# Altium schematic sheet Page 3_PMIC.SchDoc
size A2; Scale: 1:1; SheetNumber: 1; SheetTotal: 3
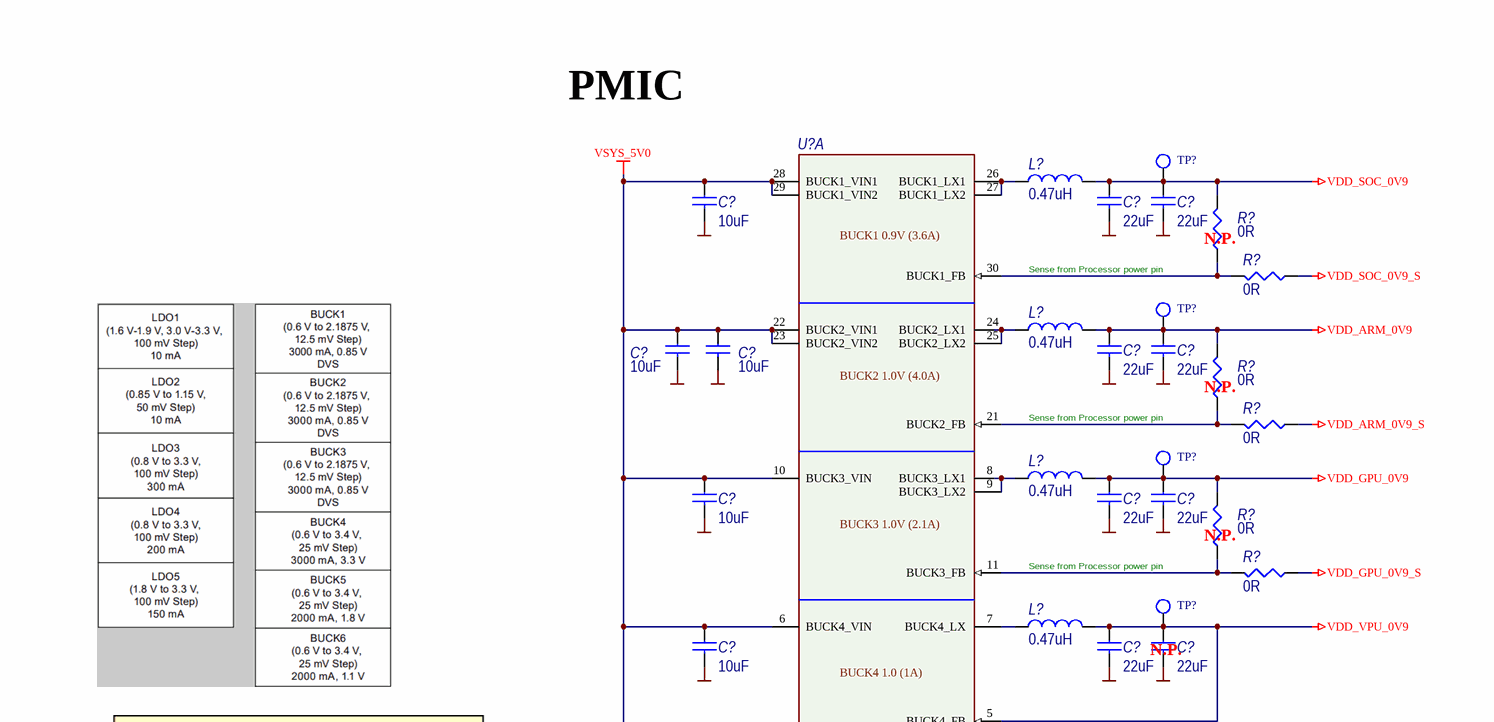
[diagram p0: Page 3_PMIC.SchDoc, top left]
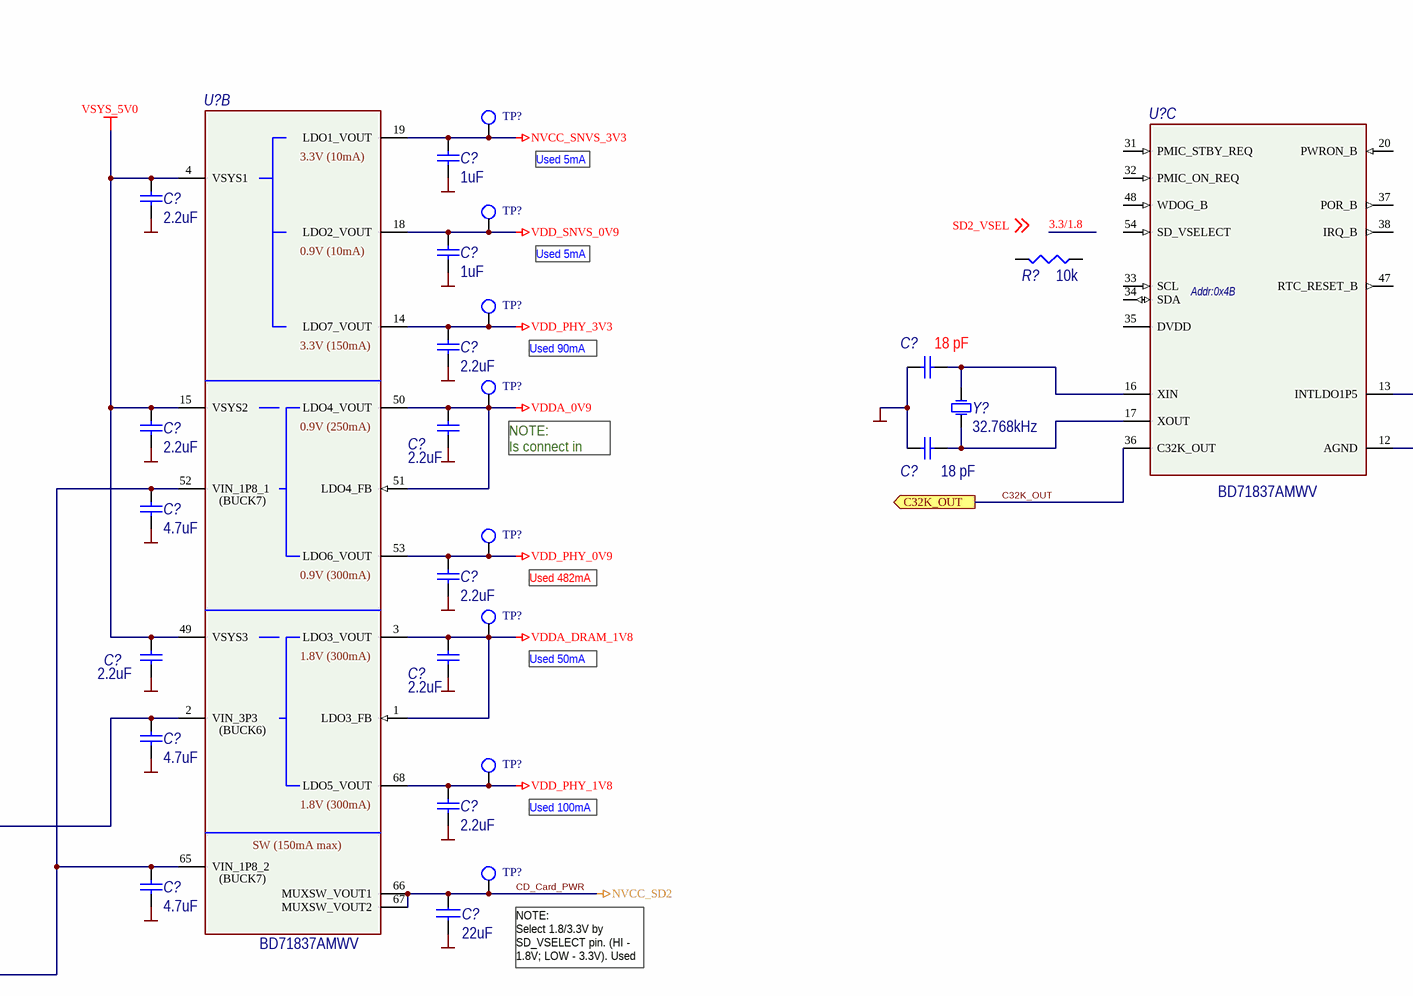
[diagram p1: Page 3_PMIC.SchDoc, top middle]
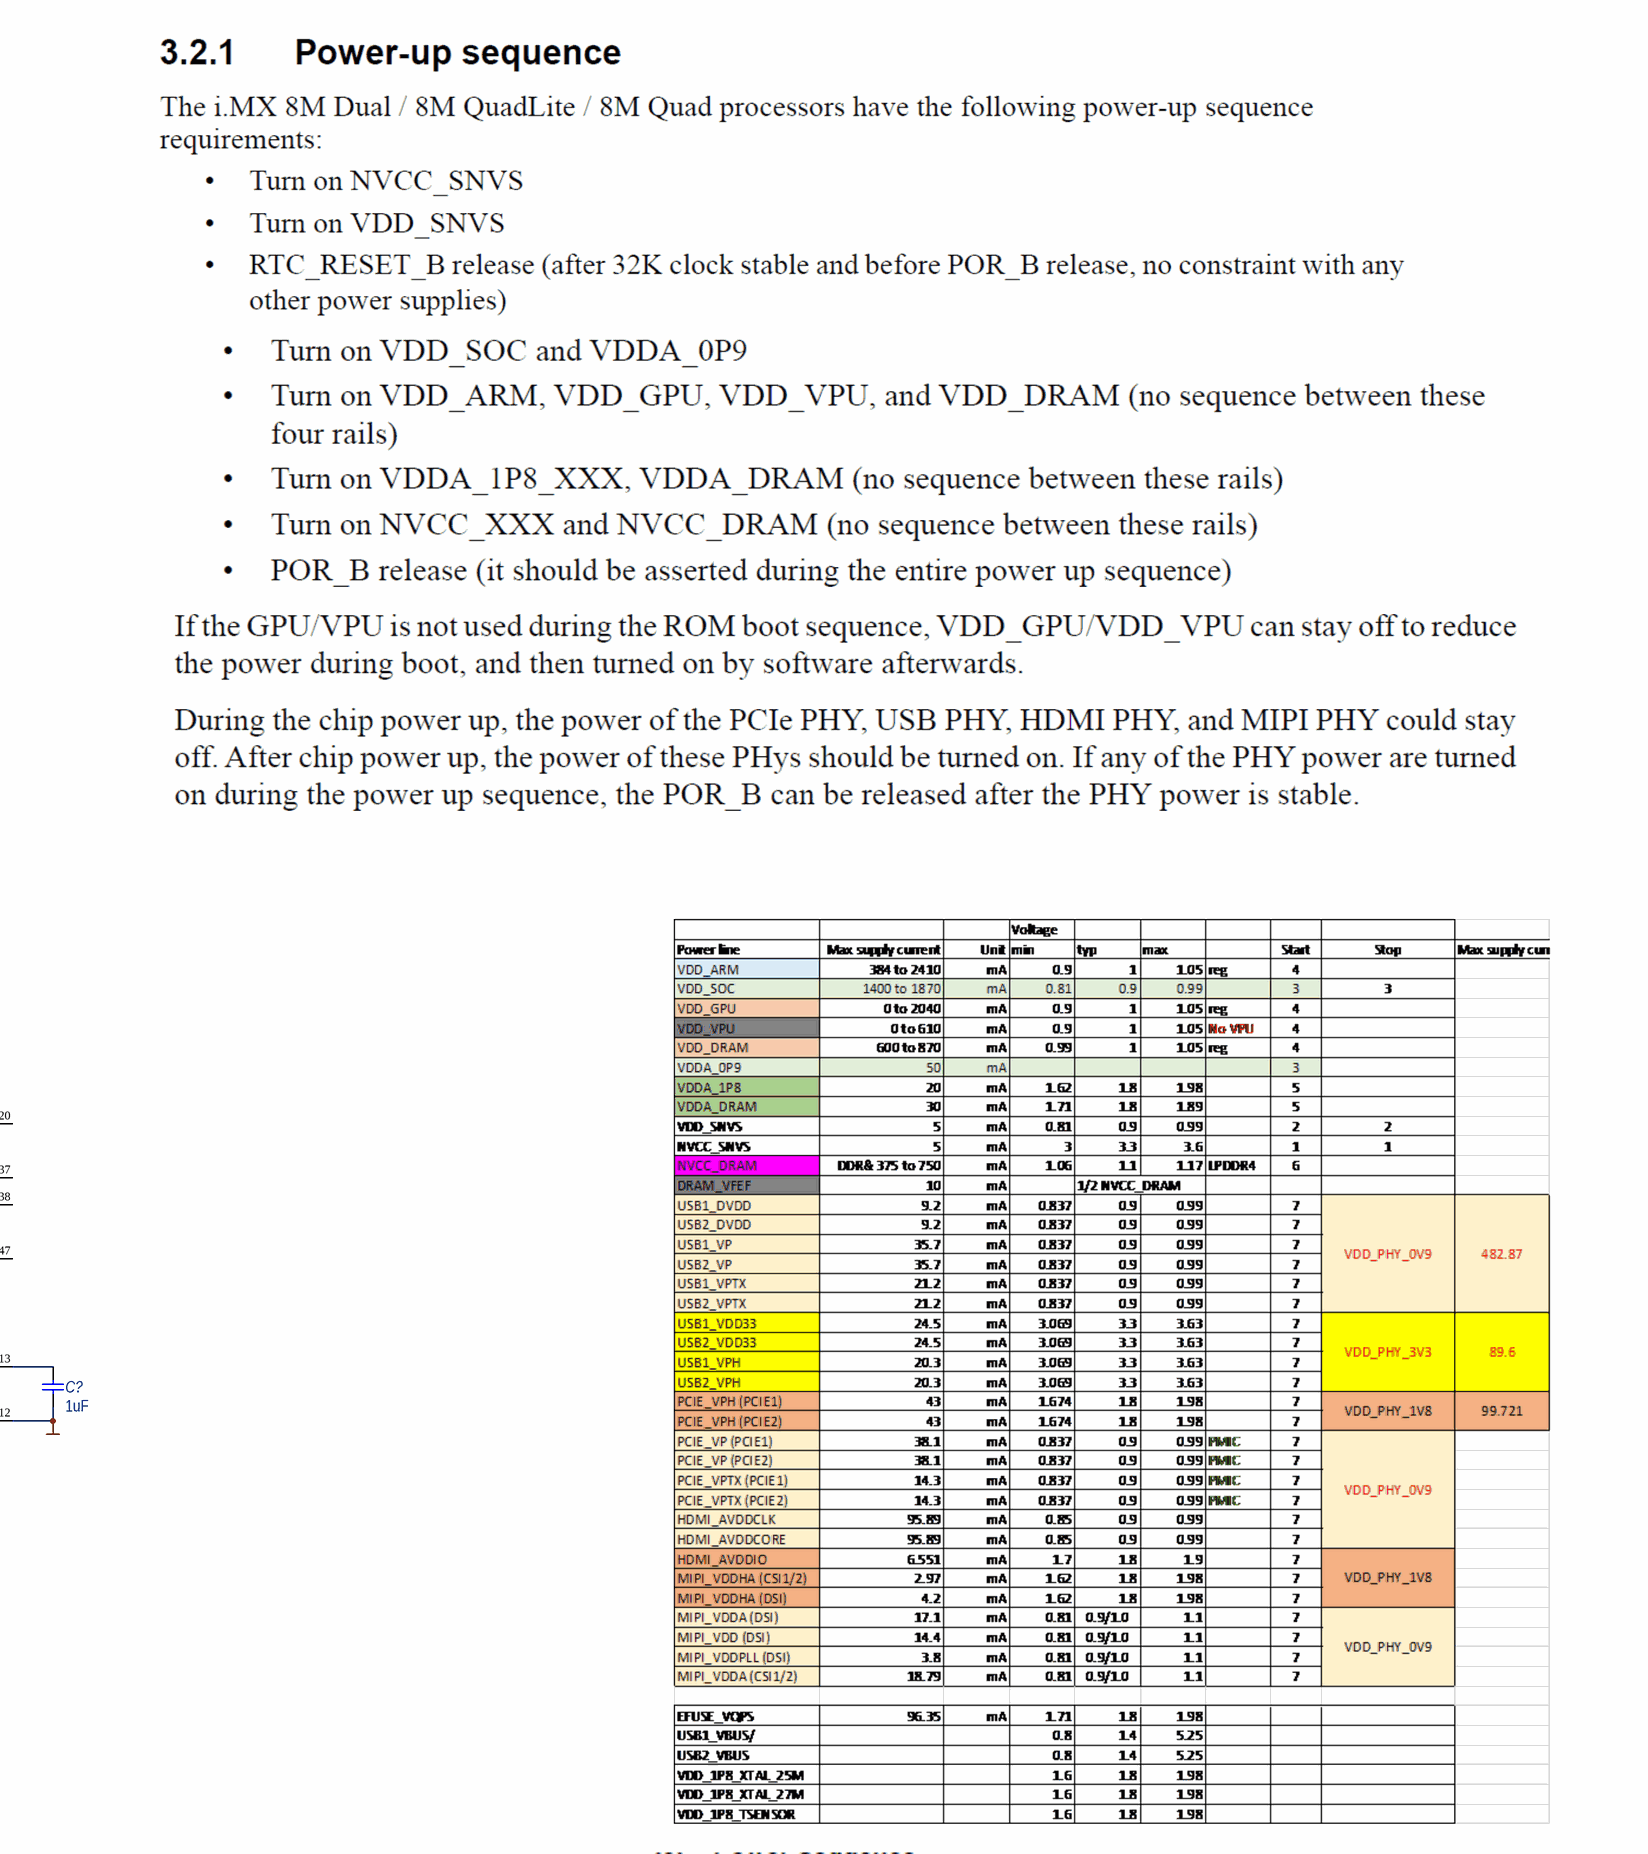
[diagram p2: Page 3_PMIC.SchDoc, top right]
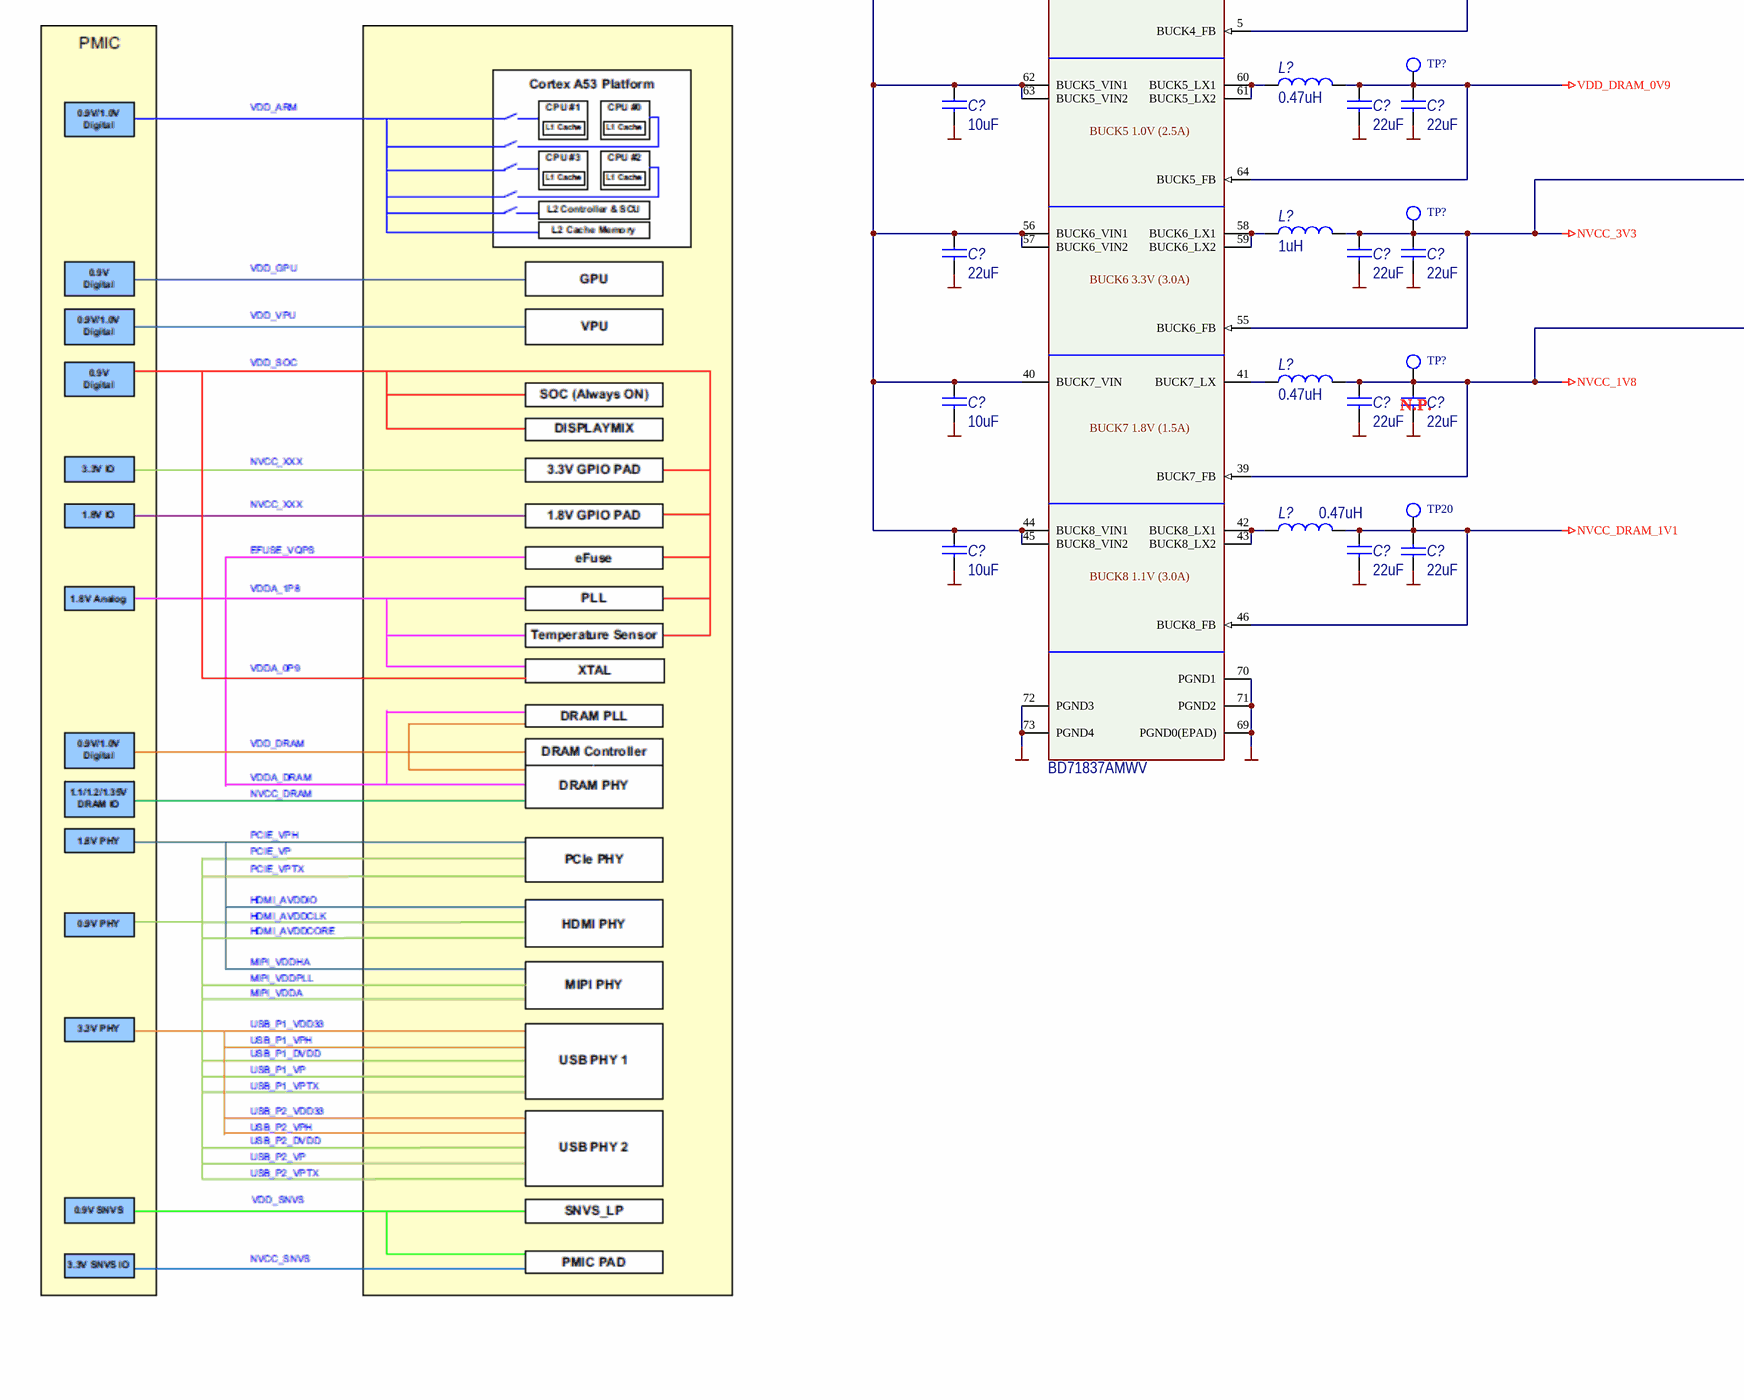
[diagram p3: Page 3_PMIC.SchDoc, bottom left]
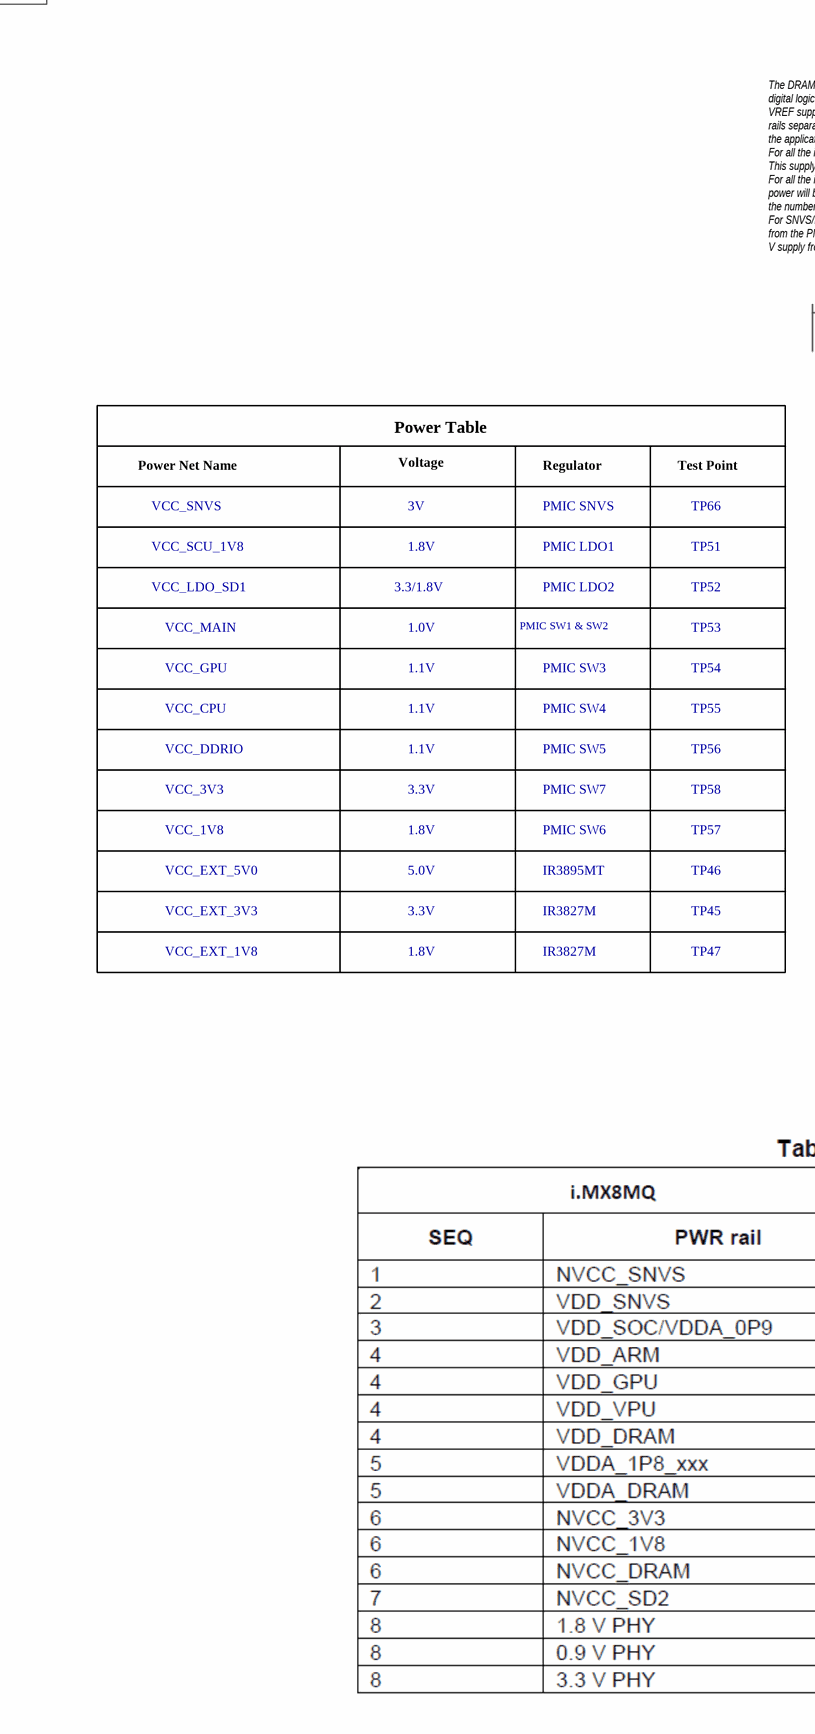
[diagram p4: Page 3_PMIC.SchDoc, bottom middle]
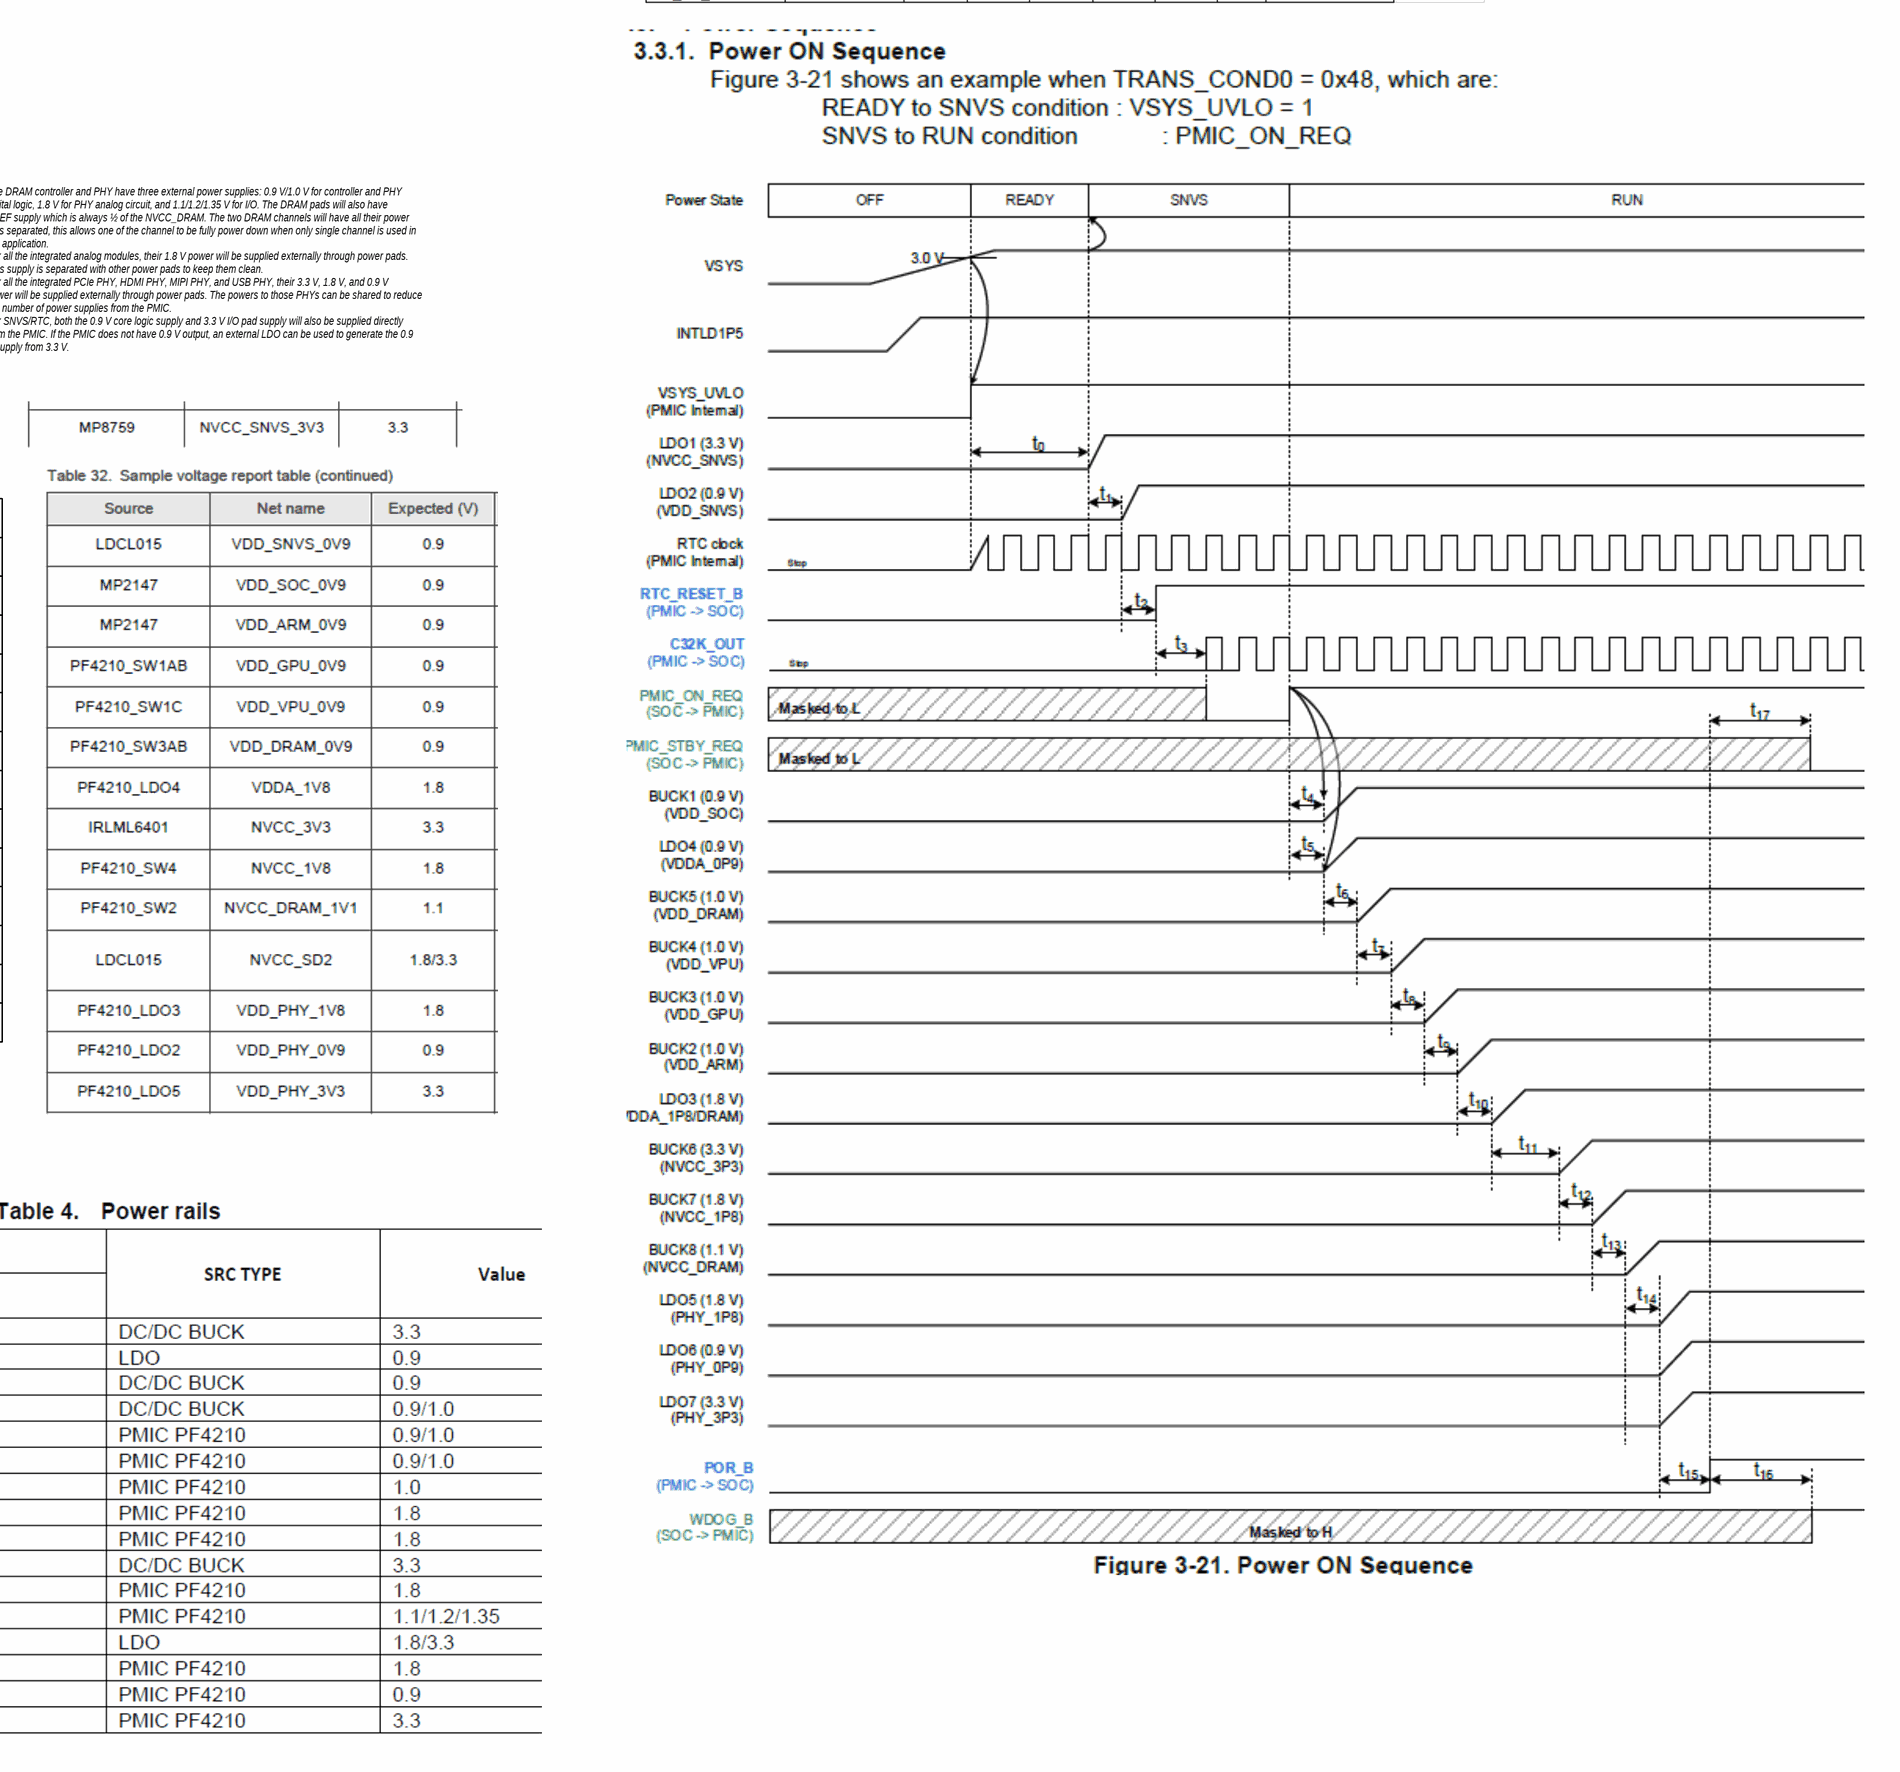
[diagram p5: Page 3_PMIC.SchDoc, bottom right]

## Parts
(Parts that share a designator on the sheet are numbered #1, #2 ... from top to bottom, then left to right.)
C?#1  10uF  [CC0603_H0.8_L-R]
C?#2  22uF  [CC0603_H0.8_L-R]
C?#3  22uF  [CC0603_H0.8_L-R]
C?#4  1uF  [CC0402_L-R]
C?#5  2.2uF  [CC0402_L-R]
C?#6  1uF  [CC0402_L-R]
C?#7  10uF  [CC0603_H0.8_L-R]
C?#8  10uF  [CC0603_H0.8_L-R]
C?#9  22uF  [CC0603_H0.8_L-R]
C?#10  22uF  [CC0603_H0.8_L-R]
C?#11  2.2uF  [CC0402_L-R]
C?#12  18 pF  [CC0402_L-R]
C?#13  1uF  [CC0402_L-R]
C?#14  2.2uF  [CC0402_L-R]
C?#15  2.2uF  [CC0402_L-R]
C?#16  10uF  [CC0603_H0.8_L-R]
C?#17  22uF  [CC0603_H0.8_L-R]
C?#18  22uF  [CC0603_H0.8_L-R]
C?#19  18 pF  [CC0402_L-R]
C?#20  4.7uF  [CC0402_L-R]
C?#21  2.2uF  [CC0402_L-R]
C?#22  10uF  [CC0603_H0.8_L-R]
C?#23  22uF  [CC0603_H0.8_L-R]
C?#24  22uF  [CC0603_H0.8_L-R]  (no BOM)
C?#25  2.2uF  [CC0402_L-R]
C?#26  2.2uF  [CC0402_L-R]
C?#27  4.7uF  [CC0402_L-R]
C?#28  10uF  [CC0603_H0.8_L-R]
C?#29  22uF  [CC0603_H0.8_L-R]
C?#30  22uF  [CC0603_H0.8_L-R]
C?#31  2.2uF  [CC0402_L-R]
C?#32  4.7uF  [CC0402_L-R]
C?#33  22uF  [CC0603_H0.8_L-R]
C?#34  22uF  [CC0603_H0.8_L-R]
C?#35  22uF  [CC0603_H0.8_L-R]
C?#36  22uF  [CC0603_H0.8_L-R]
C?#37  10uF  [CC0603_H0.8_L-R]
C?#38  22uF  [CC0603_H0.8_L-R]
C?#39  22uF  [CC0603_H0.8_L-R]  (no BOM)
C?#40  10uF  [CC0603_H0.8_L-R]
C?#41  22uF  [CC0603_H0.8_L-R]
C?#42  22uF  [CC0603_H0.8_L-R]
L?#1  0.47uH  [IND_1008_DFE252012]
L?#2  0.47uH  [IND_1008_DFE252012]
L?#3  0.47uH  [IND_1008_DFE252012]
L?#4  0.47uH  [IND_1008_DFE252012]
L?#5  0.47uH  [IND_1008_DFE252012]
L?#6  1uH  [IND_1008_DFE252012]
L?#7  0.47uH  [IND_1008_DFE252012]
L?#8  0.47uH  [IND_1008_DFE252012]
R?#1  0R  [R0402_L_R]  (no BOM)
R?#2  0R  [R0402_L_R]  (no BOM)
R?#3  10k  [R0402_L_R]
R?#4  0R  [R0402_L_R]  (no BOM)
R?#5  0R  [R0402_L_R]  (no BOM)
R?#6  0R  [R0402_L_R]  (no BOM)
R?#7  0R  [R0402_L_R]  (no BOM)
TP20  TestPoint-1  [Test_Point_dia-1mm]  (value not drawn)  (no BOM)
TP?#1  TestPoint-1  [Test_Point_dia-1mm]  (value not drawn)  (no BOM)
TP?#2  TestPoint-1  [Test_Point_dia-1mm]  (value not drawn)  (no BOM)
TP?#3  TestPoint-1  [Test_Point_dia-1mm]  (value not drawn)  (no BOM)
TP?#4  TestPoint-1  [Test_Point_dia-1mm]  (value not drawn)  (no BOM)
TP?#5  TestPoint-1  [Test_Point_dia-1mm]  (value not drawn)  (no BOM)
TP?#6  TestPoint-1  [Test_Point_dia-1mm]  (value not drawn)  (no BOM)
TP?#7  TestPoint-1  [Test_Point_dia-1mm]  (value not drawn)  (no BOM)
TP?#8  TestPoint-1  [Test_Point_dia-1mm]  (value not drawn)  (no BOM)
TP?#9  TestPoint-1  [Test_Point_dia-1mm]  (value not drawn)  (no BOM)
TP?#10  TestPoint-1  [Test_Point_dia-1mm]  (value not drawn)  (no BOM)
TP?#11  TestPoint-1  [Test_Point_dia-1mm]  (value not drawn)  (no BOM)
TP?#12  TestPoint-1  [Test_Point_dia-1mm]  (value not drawn)  (no BOM)
TP?#13  TestPoint-1  [Test_Point_dia-1mm]  (value not drawn)  (no BOM)
TP?#14  TestPoint-1  [Test_Point_dia-1mm]  (value not drawn)  (no BOM)
TP?#15  TestPoint-1  [Test_Point_dia-1mm]  (value not drawn)  (no BOM)
U?#1  BD71837AMWV  [UQFN68CV8080_ROHM]  (part A of 3)
U?#2  BD71837AMWV  [UQFN68CV8080_ROHM]  (part B of 3)
U?#3  BD71837AMWV  [UQFN68CV8080_ROHM]  (part C of 3)
Y?  32.768kHz  [FC-135_QUARTZ]

## Ports
C32K_OUT (out)

## Nets
0V: C?#1.2 C?#2.2 C?#3.2 C?#4.1 C?#5.1 C?#6.1 C?#7.2 C?#8.2 C?#9.2 C?#10.2 C?#11.1 C?#12.2 C?#13.1 C?#14.1 C?#15.1 C?#16.2 C?#17.2 C?#18.2 C?#19.2 C?#20.1 C?#21.1 C?#22.2 C?#23.2 C?#24.2 C?#25.1 C?#26.1 C?#27.1 C?#28.2 C?#29.2 C?#30.2 C?#31.1 C?#32.1 C?#33.2 C?#34.2 C?#35.2 C?#36.2 C?#37.2 C?#38.2 C?#39.2 C?#40.2 C?#41.2 C?#42.1 U?#1.69(PGND0(EPAD)) U?#1.70(PGND1) U?#1.71(PGND2) U?#1.72(PGND3) U?#1.73(PGND4) U?#3.12(AGND)
CD_Card_PWR: C?#36.1 TP?#14.1 U?#2.66(MUXSW_VOUT1) U?#2.67(MUXSW_VOUT2)  [also labelled NVCC_SD2]
NVCC_1V8: C?#20.2 C?#32.2 C?#38.1 C?#39.1 L?#7.2 TP?#15.1 U?#1.39(BUCK7_FB) U?#2.52(VIN_1P8_1) U?#2.65(VIN_1P8_2)
NVCC_3V3: C?#27.2 C?#34.1 C?#35.1 L?#6.2 TP?#13.1 U?#1.55(BUCK6_FB) U?#2.2(VIN_3P3)
NVCC_DRAM_1V1: C?#41.1 C?#42.2 L?#8.2 TP20.1 U?#1.46(BUCK8_FB)
NVCC_SNVS_3V3: C?#4.2 TP?#2.1 U?#2.19(LDO1_VOUT)
VDD_ARM_0V9: C?#9.1 C?#10.1 L?#2.2 R?#4.2 TP?#4.1
VDD_ARM_0V9_S: R?#5.1
VDD_DRAM_0V9: C?#29.1 C?#30.1 L?#5.2 TP?#11.1 U?#1.64(BUCK5_FB)
VDD_GPU_0V9: C?#17.1 C?#18.1 L?#3.2 R?#6.2 TP?#7.1
VDD_GPU_0V9_S: R?#7.1
VDD_PHY_0V9: C?#21.2 TP?#8.1 U?#2.53(LDO6_VOUT)
VDD_PHY_1V8: C?#31.2 TP?#12.1 U?#2.68(LDO5_VOUT)
VDD_PHY_3V3: C?#11.2 TP?#5.1 U?#2.14(LDO7_VOUT)
VDD_SNVS_0V9: C?#6.2 TP?#3.1 U?#2.18(LDO2_VOUT)
VDD_SOC_0V9: C?#2.1 C?#3.1 L?#1.2 R?#1.2 TP?#1.1
VDD_SOC_0V9_S: R?#2.1
VDD_VPU_0V9: C?#23.1 C?#24.1 L?#4.2 TP?#9.1 U?#1.5(BUCK4_FB)
VDDA_0V9: C?#15.2 TP?#6.1 U?#2.50(LDO4_VOUT) U?#2.51(LDO4_FB)
VDDA_DRAM_1V8: C?#26.2 TP?#10.1 U?#2.1(LDO3_FB) U?#2.3(LDO3_VOUT)
VSYS_5V0: C?#1.1 C?#5.2 C?#7.1 C?#8.1 C?#14.2 C?#16.1 C?#22.1 C?#25.2 C?#28.1 C?#33.1 C?#37.1 C?#40.1 U?#1.6(BUCK4_VIN) U?#1.10(BUCK3_VIN) U?#1.22(BUCK2_VIN1) U?#1.23(BUCK2_VIN2) U?#1.28(BUCK1_VIN1) U?#1.29(BUCK1_VIN2) U?#1.40(BUCK7_VIN) U?#1.44(BUCK8_VIN1) U?#1.45(BUCK8_VIN2) U?#1.56(BUCK6_VIN1) U?#1.57(BUCK6_VIN2) U?#1.62(BUCK5_VIN1) U?#1.63(BUCK5_VIN2) U?#2.4(VSYS1) U?#2.15(VSYS2) U?#2.49(VSYS3)
C32K_OUT: U?#3.36(C32K_OUT) ; port C32K_OUT
NetC?#12_1: C?#12.1 U?#3.16(XIN) Y?.2(OSC2)
NetC?#13_2: C?#13.2 U?#3.13(INTLDO1P5)
NetC?#19_1: C?#19.1 U?#3.17(XOUT) Y?.1(OSC1)
NetL?#1_1: L?#1.1 U?#1.26(BUCK1_LX1) U?#1.27(BUCK1_LX2)
NetL?#2_1: L?#2.1 U?#1.24(BUCK2_LX1) U?#1.25(BUCK2_LX2)
NetL?#3_1: L?#3.1 U?#1.8(BUCK3_LX1) U?#1.9(BUCK3_LX2)
NetL?#4_1: L?#4.1 U?#1.7(BUCK4_LX)
NetL?#5_1: L?#5.1 U?#1.60(BUCK5_LX1) U?#1.61(BUCK5_LX2)
NetL?#6_1: L?#6.1 U?#1.58(BUCK6_LX1) U?#1.59(BUCK6_LX2)
NetL?#7_1: L?#7.1 U?#1.41(BUCK7_LX)
NetL?#8_1: L?#8.1 U?#1.42(BUCK8_LX1) U?#1.43(BUCK8_LX2)
NetR?#1_1: R?#1.1 R?#2.2 U?#1.30(BUCK1_FB)
NetR?#4_1: R?#4.1 R?#5.2 U?#1.21(BUCK2_FB)
NetR?#6_1: R?#6.1 R?#7.2 U?#1.11(BUCK3_FB)

Not connected (* = marked no-connect by the designer): R?#3 1 2; U?#3 20(PWRON_B) 31(PMIC_STBY_REQ) 32(PMIC_ON_REQ) 33(SCL) 34(SDA) 35(DVDD) 37(POR_B) 38(IRQ_B) 47(RTC_RESET_B) 48(WDOG_B) 54(SD_VSELECT)

## Notes on the sheet
- PMIC
- (near R?#1) N.P.
- Used 5mA
- Sense from Processor power pin
- (near R?#4) N.P.
- (near TP?#5) Used 90mA
- (near TP?#6) NOTE:
  Is connect in CPU
- (near R?#6) N.P.
- (near C?#24) N.P.
- (near TP?#8) Used 482mA !
- (near TP?#10) Used 50mA
- (near TP?#12) Used 100mA
- (near TP?#14) NOTE:
  Select 1.8/3.3V by SD_VSELECT pin. (HI - 1.8V; LOW - 3.3V). Used 100mA
- (near C?#39) N.P.
- The DRAM controller and PHY have three external power supplies: 0.9 V/1.0 V for controller and PHY
  digital logic, 1.8 V for PHY analog circuit, and 1.1/1.2/1.35 V for I/O. The DRAM pads will also have
  VREF supply which is always ½ of the NVCC_DRAM. The two DRAM channels will have all their power
  rails separated, this allows one of the channel to be fully power down when only single channel is used in
  the application.
  For all the integrated analog modules, their 1.8 V power will be supplied externally through power pads.
  This supply is separated with other power pads to keep them clean.
  For all the integrated PCIe PHY, HDMI PHY, MIPI PHY, and USB PHY, their 3.3 V, 1.8 V, and 0.9 V
  power will be supplied externally through power pads. The powers to those PHYs can be shared to reduce
  the number of power supplies from the PMIC.
  For SNVS/RTC, both the 0.9 V core logic supply and 3.3 V I/O pad supply will also be supplied directly
  from the PMIC. If the PMIC does not have 0.9 V output, an external LDO can be used to generate the 0.9
  V supply from 3.3 V.
- Power Table
- Power Net Name
- VCC_SNVS
- Voltage
- 3V
- Regulator
- PMIC SNVS
- Test Point
- TP66
- VCC_SCU_1V8
- VCC_LDO_SD1
- 3.3/1.8V
- 1.8V
- PMIC LDO1
- PMIC LDO2
- TP51
- TP52
- VCC_MAIN
- 1.0V
- PMIC SW1 & SW2
- TP53
- VCC_GPU
- VCC_CPU
- 1.1V
- PMIC SW3
- PMIC SW4
- TP54
- TP55
- VCC_DDRIO
- VCC_3V3
- 3.3V
- PMIC SW5
- PMIC SW7
- TP56
- TP58
- VCC_1V8
- PMIC SW6
- TP57
- VCC_EXT_5V0
- VCC_EXT_3V3
- 5.0V
- IR3895MT
- IR3827M
- TP46
- TP45
- VCC_EXT_1V8
- TP47
- Labels drawn without touching a wire or pin: SD2_VSEL
- Title
- Size:
- Date:
- A3
- Revision:
- Sheet
- of
- Drawn By:
- Checked By:
- Black
- File:
- (in symbol BD71837AMWV, part A) BUCK1 0.9V (3.6A); BUCK2 1.0V (4.0A); BUCK3 1.0V (2.1A); BUCK4 1.0 (1A); BUCK5 1.0V (2.5A); BUCK6 3.3V (3.0A); BUCK7 1.8V (1.5A); BUCK8 1.1V (3.0A)
- (in symbol BD71837AMWV, part B) 3.3V (10mA); 0.9V (10mA); 3.3V (150mA); 0.9V (250mA); (BUCK7); 0.9V (300mA); 1.8V (300mA); (BUCK6); SW (150mA max)
- (in symbol BD71837AMWV, part C) Addr:0x4B

## Library data of the parts
C?#1 C?#7 C?#8 C?#16 C?#22 C?#28 C?#37 C?#40 = CC0603-10UF±10%-16V-X5R-MUR: CAP CER 10 uF 16V 10% X5R 0603; Manufacturer: Murata; Manufacturer Part Number: GRM188R61C106KAALD; Mount: Surface Mount; Case/Package: 0603; Case Code (Metric): 1608; Case Code (Imperial): 0603; Weight: 0.000222oz; Min Operating Temperature: -55°C; Max Operating Temperature: 85°C; Capacitance: 10uF; Packaging: Tape and Reel; Voltage Rating: 16V; Dielectric: X5R; Tolerance: 10%; Termination: SMD/SMT; Resistor Type: Ceramic; Voltage Rating (DC): 16V; Package Quantity: 4000; Length: 0.063inch; Width: 0.8mm; Height: 0.8mm; Thickness: 0.037inch; REACH SVHC: No SVHC; Lead Free: Lead Free; RoHS Compliant: Yes; ComponentLink1URL: http://www.mouser.com/ds/2/281/c02e-2905.pdf?src-supplier=Mouser; ComponentLink1Description: http://www.mouser.com/ds/2/281/c02e-2905.pdf?src-supplier=Mouser; ComponentLink2URL: http://www.farnell.com/datasheets/2079167.pdf?src-supplier=Farnell; ComponentLink2Description: http://www.farnell.com/datasheets/2079167.pdf?src-supplier=Farnell; ComponentLink3URL: http://www.farnell.com/datasheets/2079167.pdf?src-supplier=Element14; ComponentLink3Description: http://www.farnell.com/datasheets/2079167.pdf?src-supplier=Element14; ComponentLink4URL: http://www.farnell.com/datasheets/2079167.pdf?src-supplier=Newark; ComponentLink4Description: http://www.farnell.com/datasheets/2079167.pdf?src-supplier=Newark; ComponentLink5URL: https://search.murata.co.jp/Ceramy/image/img/A01X/G101/ENG/GRM188R61C106KAAL-01.pdf?src-supplier=Digi-Key; ComponentLink5Description: https://search.murata.co.jp/Ceramy/image/img/A01X/G101/ENG/GRM188R61C106KAAL-01.pdf?src-supplier=Digi-Key; Supplier 1: LCSC; Supplier Part Number 1: C86275; RoHS: Yes; Category: Ceramic Capacitors; Stock 1: 156690; Pricing 1: 500=0.0604 USD
C?#2 C?#3 C?#9 C?#10 C?#17 C?#18 C?#23 C?#24 C?#29 C?#30 C?#33-C?#36 C?#38 C?#39 C?#41 C?#42 = GRM188R61A226ME15J: CAP CER 22 uF 10V 20% X5R 0603; Manufacturer: Murata; ComponentLink1URL: http://www.murata.com/products/catalog/pdf/c02e.pdf; ComponentLink1Description: http://www.murata.com/products/catalog/pdf/c02e.pdf; Supplier 1: Digi-Key; Manufacturer Part Number: GRM188R61A226ME15J; Category: Ceramic Capacitors; Stock 1: 24355; Pricing 1: 1=0.18000, 10=0.12500, 50=0.07500, 100=0.06340, 500=0.04336, 1000=0.03835, 2500=0.03668, 5000=0.03335 (USD); Voltage Rating (DC): 10V; Dielectric: X5R; Tolerance: 20%; Value: 22uF; Length: 1.6mm; Width: 800um; Thickness: 800um; RoHS Compliant: Yes; ComponentLink2URL: http://search.murata.co.jp/Ceramy/image/img/A01X/G101/ENG/GRM188R61A226ME15-01.pdf?src-supplier=Digi-Key; ComponentLink2Description: http://search.murata.co.jp/Ceramy/image/img/A01X/G101/ENG/GRM188R61A226ME15-01.pdf?src-supplier=Digi-Key; Supplier Part Number 1: 490-GRM188R61A226ME15JCT-ND
C?#4 C?#6 C?#13 = GRM155R61E105KA12D: CAP CER 1µF 25V X5R 10% 0402 Murata; Material: Ceramic; Mount: Surface Mount; Case/Package: 0402; Case Code (Metric): 1005; Case Code (Imperial): 0402; Weight: 0.000212oz; Min Operating Temperature: -55°C; Max Operating Temperature: 85°C; Tolerance: 10%; Capacitance: 1uF; Voltage Rating: 25V; Packaging: Tape and Reel; Dielectric: X5R; Voltage: 25V; Termination: SMD/SMT; Voltage Rating (DC): 25V; Package Quantity: 10000; Series: GRM; Length: 1mm; Width: 0.5mm; Height: 0.5mm; Thickness: 0.022inch; Depth: 0.5mm; REACH SVHC: No SVHC; Lead Free: Lead Free; RoHS Compliant: Yes; ComponentLink1URL: https://datasheet.ciiva.com/22732/1666664-22732122.pdf?src-supplier=Element14; ComponentLink1Description: https://datasheet.ciiva.com/22732/1666664-22732122.pdf?src-supplier=Element14; ComponentLink2URL: https://datasheet.ciiva.com/7719/1666664-7719006.pdf?src-supplier=Element14; ComponentLink2Description: https://datasheet.ciiva.com/7719/1666664-7719006.pdf?src-supplier=Element14; Manufacturer: Murata; Manufacturer Part Number: GRM155R61E105KA12D; RoHS: Yes; Category: Ceramic Capacitors; Stock 1: 424050; Pricing 1: 50=0,03227, 500=0,02420, 1500=0,02272, 5000=0,02124, 25000=0,02058, 50000=0,02025 (USD); Supplier 1: LCSC; Supplier Part Number 1: C77009
C?#5 C?#11 C?#14 C?#15 C?#21 C?#25 C?#26 C?#31 = GRT155R61C225KE13D: CAP CER 2.2 uF 16V X5R 10% 0402 Murata; Supplier 1: Digi-Key; Supplier Part Number 1: 490-12259-1-ND; Manufacturer: Murata; Manufacturer Part Number: GRT155R61C225KE13D; Category: Ceramic Capacitors; Stock 1: 60026; Pricing 1: 1=0.16000, 10=0.11000, 50=0.06260, 100=0.05190, 500=0.03638, 1000=0.03012, 2500=0.02803, 5000=0.02565 (USD); Mounting Technology: Surface Mount; Case/Package: 0402; Case Code (Metric): 1005; Case Code (Imperial): 0402; Min Operating Temperature: -55°C; Max Operating Temperature: 85°C; Packaging: Tape and Reel; Value: 2.2uF; Voltage Rating: 16V; Tolerance: 10%; Length: 0.039inch; Width: 0.02inch; Thickness: 0.022inch; Ratings: AEC-Q200; RoHS Compliant: Yes; ComponentLink1URL: http://search.murata.co.jp/Ceramy/image/img/A01X/G101/ENG/GRT155R61C225KE13-01.pdf?src-supplier=Digi-Key; ComponentLink1Description: http://search.murata.co.jp/Ceramy/image/img/A01X/G101/ENG/GRT155R61C225KE13-01.pdf?src-supplier=Digi-Key
C?#12 C?#19 = GRM1555C1H120JA01D: CAP CER 12 pF 50V C0G 5% 0402 Murata; Material: Ceramic; Capacitance: 12pF; Temperature Coefficient: 30ppm/°C; Mount: Surface Mount; Case/Package: 0402; Number of Pins: 2; Case Code (Imperial): 0402; Case Code (Metric): 1005; Min Operating Temperature: -55°C; Max Operating Temperature: 125°C; Dielectric: C0G; Tolerance: 5%; Voltage Rating: 50V; Packaging: Tape and Reel; Voltage Rating (DC): 50V; Package Quantity: 10000; Termination: SMD/SMT; Voltage: 50V; Series: GRM; Construction: Flat; Length: 1mm; Width: 0.5mm; Height: 0.5mm; Thickness: 0.022inch; Depth: 0.5mm; Radiation Hardening: No; Lead Free: Lead Free; RoHS Compliant: Yes; REACH SVHC: No SVHC; ComponentLink1URL: https://datasheet.ciiva.com/22698/1747438-22698389.pdf?src-supplier=Element14; ComponentLink1Description: https://datasheet.ciiva.com/22698/1747438-22698389.pdf?src-supplier=Element14; ComponentLink2URL: https://datasheet.ciiva.com/6271/grm1555c1h120ja01-01-6271078.pdf?src-supplier=Digi-Key; ComponentLink2Description: https://datasheet.ciiva.com/6271/grm1555c1h120ja01-01-6271078.pdf?src-supplier=Digi-Key; ComponentLink3URL: https://datasheet.ciiva.com/11789/0900766b80ef921d-11789079.pdf?src-supplier=RSComponents; ComponentLink3Description: https://datasheet.ciiva.com/11789/0900766b80ef921d-11789079.pdf?src-supplier=RSComponents; ComponentLink4URL: https://datasheet.ciiva.com/18184/getdatasheetpartid-316477-18184186.pdf?src-supplier=Verical; ComponentLink4Description: https://datasheet.ciiva.com/18184/getdatasheetpartid-316477-18184186.pdf?src-supplier=Verical; ComponentLink5URL: https://datasheet.ciiva.com/29200/453581-da-01-en-vs-kondensator-0402-29200129.pdf?src-supplier=Conrad; ComponentLink5Description: https://datasheet.ciiva.com/29200/453581-da-01-en-vs-kondensator-0402-29200129.pdf?src-supplier=Conrad; ComponentLink6URL: https://datasheet.ciiva.com/6271/partnumbering-e-01-6271081.pdf?src-supplier=Digi-Key; ComponentLink6Description: https://datasheet.ciiva.com/6271/partnumbering-e-01-6271081.pdf?src-supplier=Digi-Key; ComponentLink7URL: https://datasheet.ciiva.com/6271/partnumbering-e-01-6271084.pdf?src-supplier=Digi-Key; ComponentLink7Description: https://datasheet.ciiva.com/6271/partnumbering-e-01-6271084.pdf?src-supplier=Digi-Key; Supplier 1: LCSC; Supplier Part Number 1: C76948; Manufacturer: Murata; Manufacturer Part Number: GRM1555C1H120JA01D; RoHS: Yes; Category: Ceramic Capacitors; Stock 1: 191700; Pricing 1: 100=0,01337, 1000=0,01003, 3000=0,00942, 10000=0,00880, 50000=0,00853, 100000=0,00840 (USD)
C?#20 C?#27 C?#32 = GRM155R61A475KEAAD: CAP CER 4.7uF 10V X5R 10% 0402 Murata; RoHS Compliant: Yes; Supplier 1: LCSC; Supplier Part Number 1: C77004; Manufacturer: Murata; Manufacturer Part Number: GRM155R61A475KEAAD; ComponentLink1Description: DS; ComponentLink1URL: https://datasheet.lcsc.com/lcsc/1811081617_Murata-Electronics-GRM155R61A475KEAAD_C77004.pdf; ComponentLink2Description: LCSC; ComponentLink2URL: https://lcsc.com/product-detail/Multilayer-Ceramic-Capacitors-MLCC-SMD-SMT_Murata-Electronics-GRM155R61A475KEAAD_C77004.html; RoHS: Yes; Category: Ceramic Capacitors; Stock 1: 285900; Pricing 1: 50=0,09257, 500=0,06813, 1500=0,06364, 5000=0,05915, 25000=0,05715, 50000=0,05617 (USD)
L?#1-L?#5 L?#7 L?#8 = DFE252012F-R47M=P2: 0.47uH ±20% 4.9A 23mΩ SMD 1008 Power Inductors; Manufacturer: Murata; Core Material: Ferrite; Value: 470nH; Saturation Current: 7.4A; Shielding: Shielded; DC Resistance (DCR): 23mR; Test Frequency: 1MHz; Supplier 1: Digi-Key; Supplier Part Number 1: 490-13049-1-ND; Manufacturer Part Number: DFE252012F-R47M=P2; Category: Fixed Inductors; Stock 1: 16429; Pricing 1: 1=0.35000, 10=0.31500, 25=0.27560, 50=0.23640, 100=0.21660, 250=0.19696, 500=0.18514, 1000=0.14180 (USD); Mounting Technology: Surface Mount; Case/Package: 1008; Case Code (Metric): 2520; Case Code (Imperial): 1008; Min Operating Temperature: -40°C; Max Operating Temperature: 125°C; Packaging: Cut Tape; Current Rating: 4.9A; Tolerance: 20%; Length: 0.098inch; Width: 0.079inch; Height - Seated (Max): 0.047inch; RoHS Compliant: Yes; ComponentLink1URL: https://www.murata.com/~/media/webrenewal/products/inductor/chip/tokoproducts/wirewoundmetalalloychiptype/m_dfe252012f.ashx?src-supplier=Digi-Key; ComponentLink1Description: https://www.murata.com/~/media/webrenewal/products/inductor/chip/tokoproducts/wirewoundmetalalloychiptype/m_dfe252012f.ashx?src-supplier=Digi-Key; ComponentLink2URL: http://www.murata.com/~/media/webrenewal/products/inductor/chip/tokoproducts/wirewoundmetalalloychiptype/m_dfe252012f.ashx?src-supplier=Digi-Key; ComponentLink2Description: http://www.murata.com/~/media/webrenewal/products/inductor/chip/tokoproducts/wirewoundmetalalloychiptype/m_dfe252012f.ashx?src-supplier=Digi-Key
L?#6 = DFE252012P-1R0M=P2: 1uH ±20% 3.2A 42mΩ SMD 1008 Power Inductors; Manufacturer: Murata; Core Material: Ferrite; Current Rating: 4.3A; Shielding: Shielded; DC Resistance (DCR): 42mR; Test Frequency: 1MHz; Supplier 1: Farnell; Supplier Part Number 1: 2530071; Manufacturer Part Number: DFE252012P-1R0M=P2; Category: Fixed Inductors; Stock 1: 67081; Pricing 1: 5=0,19400, 50=0,16200, 250=0,16100, 500=0,16000, 1500=0,15900, 3000=0,15700, 15000=0,15600, 30000=0,15500 (EUR); Mounting Technology: Surface Mount; Case/Package: 1008; Case Code (Metric): 2520; Case Code (Imperial): 1008; Min Operating Temperature: -40°C; Max Operating Temperature: 125°C; Packaging: Tape and Reel; Value: 1uH; Resistor Type: Wirewound,Metal Alloy; Max DC Current: 3.2A; Tolerance: 20%; Length: 0.098inch; Width: 0.079inch; Height - Seated (Max): 0.039inch; Depth: 2mm; RoHS Compliant: Yes; ComponentLink1URL: http://www.farnell.com/datasheets/2550134.pdf?src-supplier=Farnell; ComponentLink1Description: http://www.farnell.com/datasheets/2550134.pdf?src-supplier=Farnell; ComponentLink2URL: https://www.murata.com/~/media/webrenewal/products/inductor/chip/tokoproducts/wirewoundmetalalloychiptype/m_dfe252012p.ashx?src-supplier=Digi-Key; ComponentLink2Description: https://www.murata.com/~/media/webrenewal/products/inductor/chip/tokoproducts/wirewoundmetalalloychiptype/m_dfe252012p.ashx?src-supplier=Digi-Key; ComponentLink3URL: http://www.murata.com/~/media/webrenewal/products/inductor/chip/tokoproducts/wirewoundmetalalloychiptype/m_dfe252012p.ashx?src-supplier=Digi-Key; ComponentLink3Description: http://www.murata.com/~/media/webrenewal/products/inductor/chip/tokoproducts/wirewoundmetalalloychiptype/m_dfe252012p.ashx?src-supplier=Digi-Key; ComponentLink4URL: http://www.toko.co.jp/products/pdf/inductors/dfe252012p.pdf?src-supplier=Avnet; ComponentLink4Description: http://www.toko.co.jp/products/pdf/inductors/dfe252012p.pdf?src-supplier=Avnet
R?#1 R?#2 R?#4-R?#7 = RC0402JR-070RL: RES 0 OHM 1/16W 0402; Manufacturer: Yageo; Resistance (Ohms): 0.0; Power (Watts): 0.063W, 1/16W; Tolerance: Jumper; .Checked PCB: used; Category: Resistors; Supplier Part Number: 311-0.0JRCT-ND; Manufacturer Part Number: RC0402JR-070RL; Package / Case: 0402 (1005 Metric); Price 1k [$]: 0.01389; Value: 0R; .Checked SCH: used; Supplier: Digikey; Supplier 1: Digi-Key; Supplier Part Number 1: 311-0.0JRCT-ND; RoHS: RoHS Compliant; Stock 1: 1106330; Pricing 1: 1000=0.0005 (USD); Composition: Thick Film; Features: -; Temperature Coefficient: -; Size / Dimension: 0.039" L x 0.020" W (1.00mm x 0.50mm); Height: 0.016" (0.40mm); Number of Terminations: 2; Packaging: Cut Tape (CT); ComponentLink1URL: http://www.yageo.com/documents/recent/PYu-RC0402_51_RoHS_L_6.pdf; ComponentLink1Description: http://www.yageo.com/documents/recent/PYu-RC0402_51_RoHS_L_6.pdf
R?#3 = RC0402FR-0710KL: RES 10.0K OHM 1/16W 1% 0402; Manufacturer: Yageo; Power (Watts): 0.063W, 1/16W; .Checked PCB: used; Temperature Coefficient: ±100ppm/°C; Category: Resistors; Supplier Part Number: 311-10.0KLRCT-ND; Manufacturer Part Number: RC0402FR-0710KL; Package / Case: 0402 (1005 Metric); Price 1k [$]: 0.01421; Resistance (Ohms): 10K; Tolerance: ±1%; Value: 10k; .Checked SCH: used; Supplier: Digikey; Supplier 1: Digi-Key; Supplier Part Number 1: 311-10.0KLRCT-ND; RoHS: RoHS Compliant; Stock 1: 2916495; Pricing 1: 10=0.014, 50=0.0104, 100=0.0079, 250=0.00584, 500=0.00432, 1000=0.00288 (USD); Composition: Thick Film; Features: -; Size / Dimension: 0.039" L x 0.020" W (1.00mm x 0.50mm); Height: 0.016" (0.40mm); Number of Terminations: 2; Packaging: Cut Tape (CT); ComponentLink1URL: http://www.yageo.com/documents/recent/PYu-RC0402_51_RoHS_L_6.pdf; ComponentLink1Description: http://www.yageo.com/documents/recent/PYu-RC0402_51_RoHS_L_6.pdf
TP20 TP?#1-TP?#15 = TestPoint-1: TestPoint Dia-1mm
U?#1-U?#3 = BD71837AMWV: PMIC for I.MX8M 8DC-DC 7 LDO UQFN68CV8080 ROHM; Manufacturer Part Number: BD71837AMWV-E2; Supplier 1: Farnell; Supplier Part Number 1: 3011442; Manufacturer: Rohm; Category: Voltage Regulators - Switching; Stock 1: 620
  U?#1 U?#2: Pricing 1: 1=5,14000, 10=5,04000, 25=4,94000, 50=4,83000, 100=4,73000, 250=4,63000, 500=4,53000 (EUR)
Y? = ABS07-32.768KHZ-T: Crystals 32.768KHz 20ppm 12.5pF -40C +85C; Manufacturer: Abracon; ESR (Equivalent Series Resistance): 70kR; Supplier 1: Digi-Key; Supplier Part Number 1: 535-9542-1-ND; Manufacturer Part Number: ABS07-32.768KHZ-T; Category: Crystals; Stock 1: 1827108; Pricing 1: 1=0,69000, 10=0,57600, 50=0,51840, 100=0,46070, 500=0,43768, 1000=0,36858 (USD); Case/Package: CSMD; Pins: 2; Min Operating Temperature: -40°C; Max Operating Temperature: 85°C; Frequency Tolerance: 20ppm; Load Capacitance: 12.5pF; Frequency: 32.768kHz; Packaging: Tape and Reel; Package Quantity: 3000; Tolerance: 20ppm; Termination: SMD/SMT; ESR: 70kR; Series: ABS07; Operating Frequency: 32.768 kHz; Length: 3.2mm; Width: 1.5mm; Height: 0.9mm; Depth: 1.5mm; Radiation Hardening: No; RoHS Compliant: Yes; Lead Free: Lead Free; Reach SVHC Compliant: Yes; ComponentLink1URL: https://datasheet.ciiva.com/7998/1912628-7998667.pdf?src-supplier=Element14; ComponentLink1Description: https://datasheet.ciiva.com/7998/1912628-7998667.pdf?src-supplier=Element14; ComponentLink2URL: https://datasheet.ciiva.com/1357/1883680-1357319.pdf?src-supplier=Element14; ComponentLink2Description: https://datasheet.ciiva.com/1357/1883680-1357319.pdf?src-supplier=Element14; ComponentLink3URL: https://datasheet.ciiva.com/854/abs07-854936.pdf?src-supplier=Digi-Key; ComponentLink3Description: https://datasheet.ciiva.com/854/abs07-854936.pdf?src-supplier=Digi-Key; ComponentLink4URL: https://datasheet.ciiva.com/854/abs07-854935.pdf?src-supplier=Digi-Key; ComponentLink4Description: https://datasheet.ciiva.com/854/abs07-854935.pdf?src-supplier=Digi-Key; ComponentLink5URL: https://datasheet.ciiva.com/854/abs07-854937.pdf?src-supplier=Digi-Key; ComponentLink5Description: https://datasheet.ciiva.com/854/abs07-854937.pdf?src-supplier=Digi-Key; ComponentLink6URL: https://datasheet.ciiva.com/4944/abs07-11028-4944830.pdf?src-supplier=Mouser; ComponentLink6Description: https://datasheet.ciiva.com/4944/abs07-11028-4944830.pdf?src-supplier=Mouser; ComponentLink7URL: https://datasheet.ciiva.com/15214/getdatasheetpartid-727011-15214954.pdf?src-supplier=Verical; ComponentLink7Description: https://datasheet.ciiva.com/15214/getdatasheetpartid-727011-15214954.pdf?src-supplier=Verical